# EAGLE design Gamebadge3_revD (EAGLE 8.7.1)
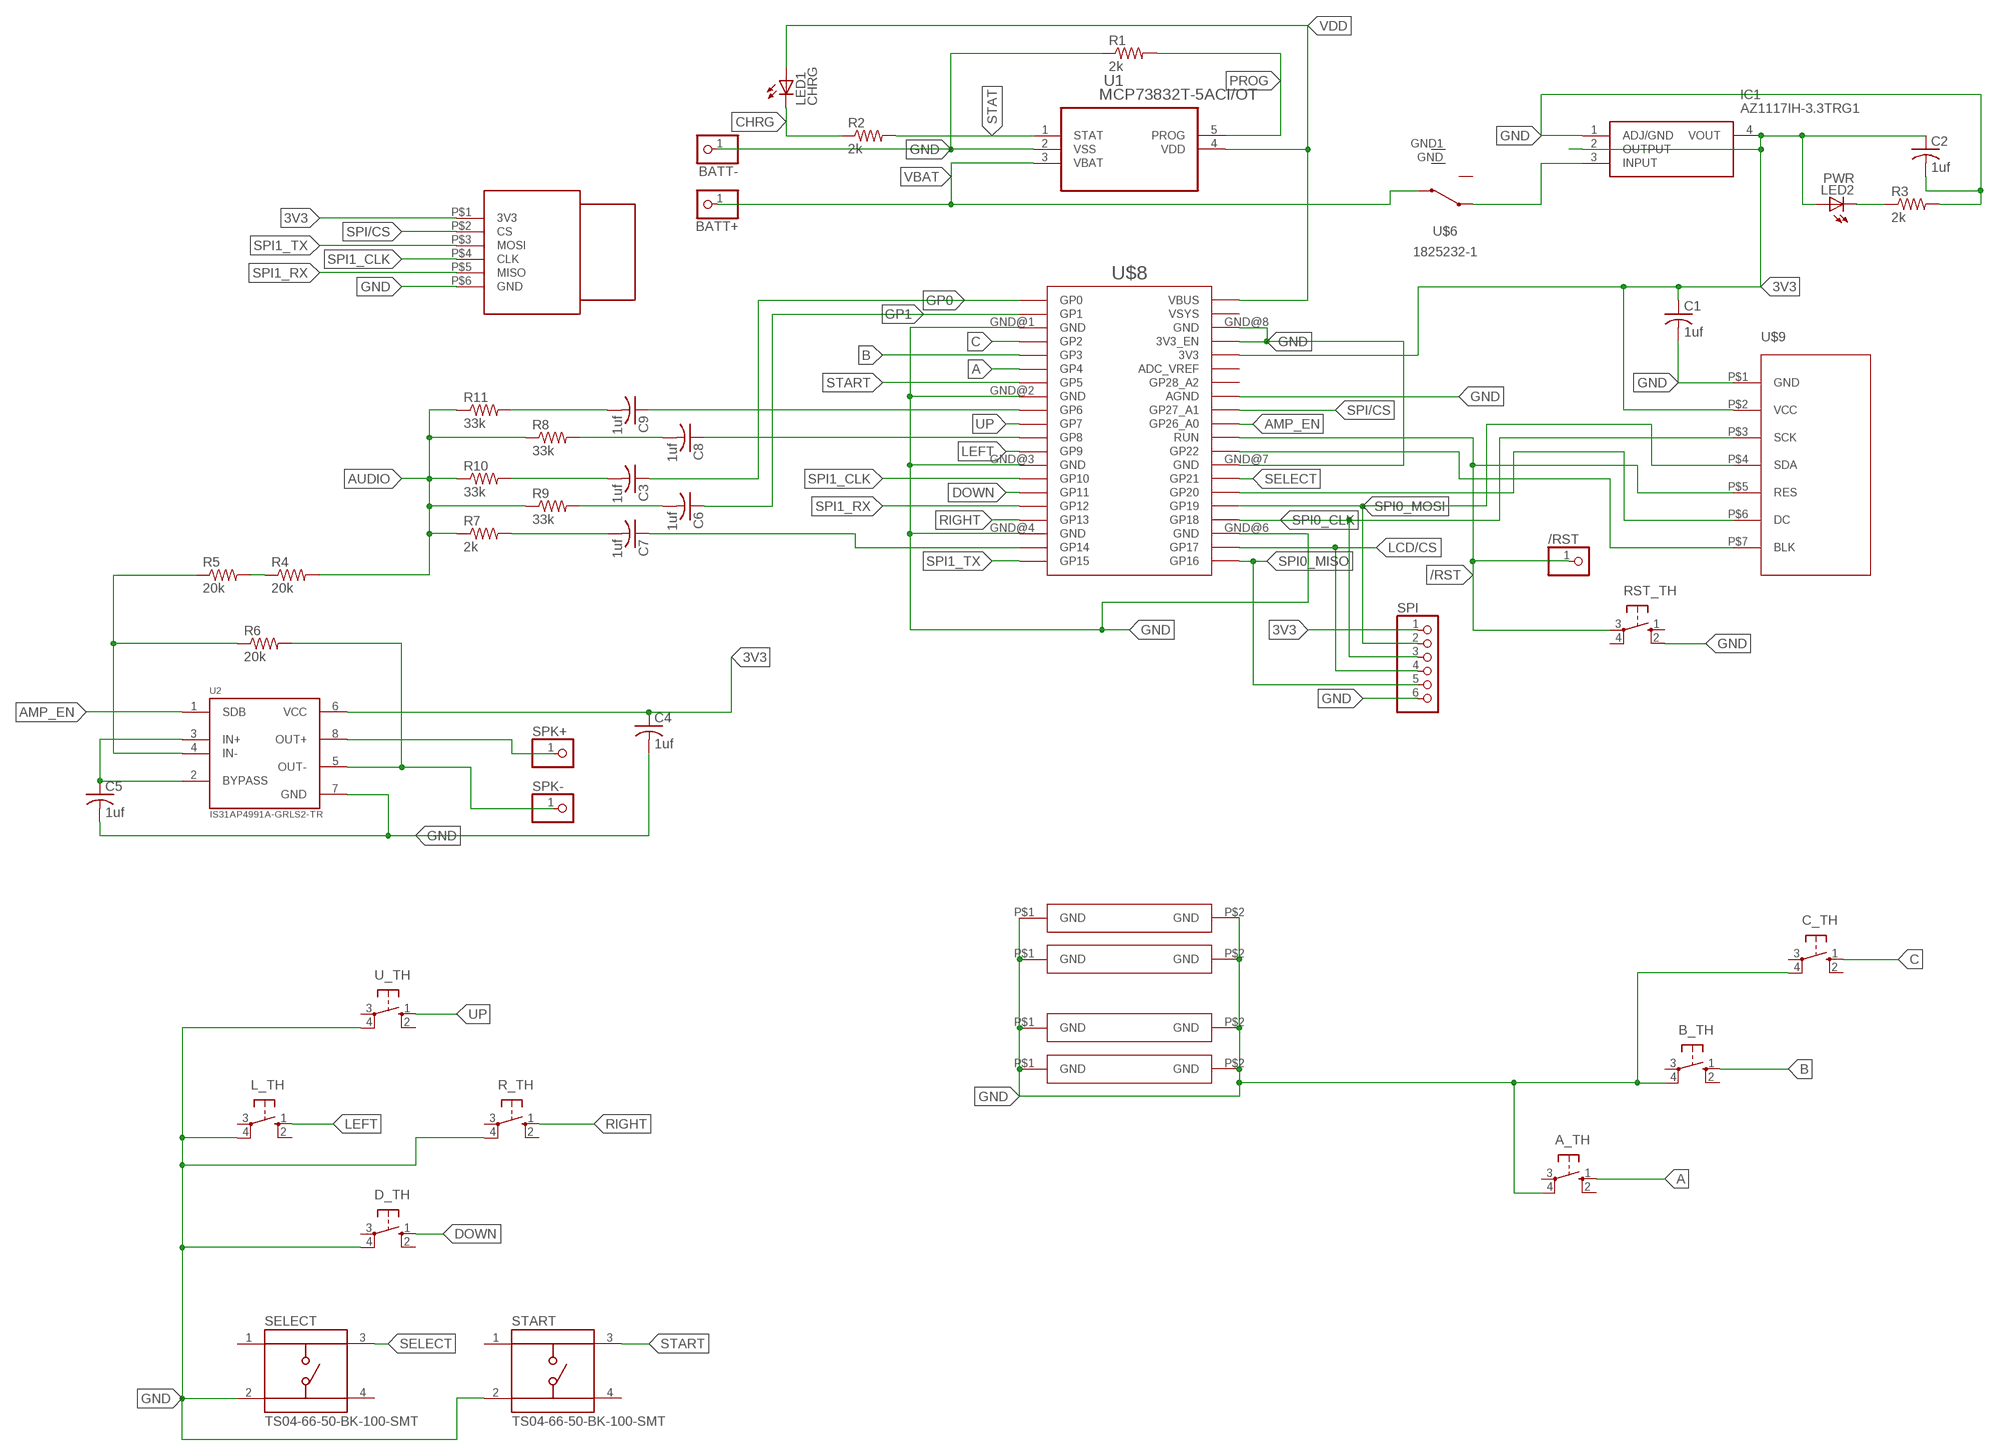
[diagram p0: schematic, sheet 1]

## Parts
/RST  PINHD-1X1  [1X01]
A_TH  10-XX  [B3F-10XX]
B_TH  10-XX  [B3F-10XX]
BATT+  PINHD-1X1  [1X01]
BATT-  PINHD-1X1  [1X01]
C1  1uf  C-USC0805  [C0805]
C2  1uf  C-USC0805  [C0805]
C3  1uf  C-USC0805  [C0805]
C4  1uf  C-USC0805  [C0805]
C5  1uf  C-USC0805  [C0805]
C6  1uf  C-USC0805  [C0805]
C7  1uf  C-USC0805  [C0805]
C8  1uf  C-USC0805  [C0805]
C9  1uf  C-USC0805  [C0805]
C_TH  10-XX  [B3F-10XX]
D_TH  10-XX  [B3F-10XX]
IC1  AZ1117IH-3.3TRG1  [SOT230P700X170-4N]
L_TH  10-XX  [B3F-10XX]
LED1  CHRG  LED3MM  [LED3MM]
LED2  PWR  LED3MM  [LED3MM]
R1  2k  R-US_R0805  [R0805]
R2  2k  R-US_R0805  [R0805]
R3  2k  R-US_R0805  [R0805]
R4  20k  R-US_R0805  [R0805]
R5  20k  R-US_R0805  [R0805]
R6  20k  R-US_R0805  [R0805]
R7  2k  R-US_R0805  [R0805]
R8  33k  R-US_R0805  [R0805]
R9  33k  R-US_R0805  [R0805]
R10  33k  R-US_R0805  [R0805]
R11  33k  R-US_R0805  [R0805]
R_TH  10-XX  [B3F-10XX]
RST_TH  10-XX  [B3F-10XX]
SELECT  TS04-66-50-BK-100-SMT  [SW_TS04-66-50-BK-100-SMT]
SPI  PINHD-1X6  [1X06]
SPK+  PINHD-1X1  [1X01]
SPK-  PINHD-1X1  [1X01]
START  TS04-66-50-BK-100-SMT  [SW_TS04-66-50-BK-100-SMT]
U1  MCP73832T-5ACI/OT  [SOT95P300X145-5N]
U2  IS31AP4991A-GRLS2-TR  [SOIC127P604X170-8N]
U$1  SD_CARD_ADAPTER  [SD_CARD]
U$2  GND_CLIP  [GND_CLIP]
U$3  GND_CLIP  [GND_CLIP]
U$4  GND_CLIP  [GND_CLIP]
U$5  GND_CLIP  [GND_CLIP]
U$6  1825232-1  [1825232-1]
U$8  RPI_PICO_W  [RPI_PICO_W]
U$9  ST7789  [ST7789]
U_TH  10-XX  [B3F-10XX]

## Nets
3V3: C1.1 C2.1 C4.1 IC1.2(OUTPUT) IC1.4(VOUT) LED2.A SPI.1 U2.6(VCC) U$1.P$1(3V3) U$8.3V3 U$9.P$2(VCC)
/RST: /RST.1 RST_TH.3(P) U$8.RUN U$9.P$5(RES)
A: A_TH.1(S) U$8.GP4
AMP_EN: U2.1(SDB) U$8.GP26_A0
AUDIO: R4.2 R7.1 R8.1 R9.1 R10.1 R11.1
B: B_TH.1(S) U$8.GP3
C: C_TH.1(S) U$8.GP2
CHRG: LED1.K(C) R2.1
DOWN: D_TH.1(S) U$8.GP11
GND: A_TH.4(P1) B_TH.4(P1) BATT-.1 C1.2 C2.2 C4.2 C5.2 C_TH.4(P1) D_TH.4(P1) IC1.1(ADJ/GND) L_TH.4(P1) R1.1 R3.2 R_TH.4(P1) RST_TH.2(S1) SELECT.2 SPI.6 START.2 U1.2(VSS) U2.7(GND) U$1.P$6(GND) U$2.P$1(GND) U$2.P$2(GND) U$3.P$1(GND) U$3.P$2(GND) U$4.P$1(GND) U$4.P$2(GND) U$5.P$1(GND) U$5.P$2(GND) U$8.3V3_EN U$8.AGND U$8.GND@1(GND) U$8.GND@2(GND) U$8.GND@3(GND) U$8.GND@4(GND) U$8.GND@6(GND) U$8.GND@7(GND) U$8.GND@8(GND) U$9.P$1(GND) U_TH.4(P1)
GP0: C3.1 U$8.GP0
GP1: C6.1 U$8.GP1
LCD/CS: SPI.4 U$8.GP17
LEFT: L_TH.1(S) U$8.GP9
N$1: C5.1 U2.2(BYPASS) U2.3(IN+)
N$3: U$8.GP20 U$9.P$6(DC)
N$4: R4.1 R5.2
N$5: U$8.GP22 U$9.P$7(BLK)
N$6: R5.1 R6.1 U2.4(IN-)
N$7: IC1.3(INPUT) U$6.3
N$8: R6.2 SPK-.1 U2.5(OUT-)
N$9: LED2.K(C) R3.1
N$10: SPK+.1 U2.8(OUT+)
N$12: C7.1 U$8.GP14
N$14: C6.2 R9.2
N$15: C7.2 R7.2
N$16: C8.1 U$8.GP8
N$17: C8.2 R8.2
N$18: C3.2 R10.2
N$22: C9.1 U$8.GP6
N$23: C9.2 R11.2
PROG: R1.2 U1.5(PROG)
RIGHT: R_TH.1(S) U$8.GP13
SELECT: SELECT.3 U$8.GP21
SPI0_CLK: SPI.3 U$8.GP18 U$9.P$3(SCK)
SPI0_MISO: SPI.5 U$8.GP16
SPI0_MOSI: SPI.2 U$8.GP19 U$9.P$4(SDA)
SPI1_CLK: U$1.P$4(CLK) U$8.GP10
SPI1_RX: U$1.P$5(MISO) U$8.GP12
SPI1_TX: U$1.P$3(MOSI) U$8.GP15
SPI/CS: U$1.P$2(CS) U$8.GP27_A1
START: START.3 U$8.GP5
STAT: R2.2 U1.1(STAT)
UP: U$8.GP7 U_TH.1(S)
VBAT: BATT+.1 U1.3(VBAT) U$6.2
VDD: LED1.A U1.4(VDD) U$8.VBUS
Unconnected: A_TH.2(S1) A_TH.3(P) B_TH.2(S1) B_TH.3(P) C_TH.2(S1) C_TH.3(P) D_TH.2(S1) D_TH.3(P) L_TH.2(S1) L_TH.3(P) R_TH.2(S1) R_TH.3(P) RST_TH.1(S) RST_TH.4(P1) SELECT.1 SELECT.4 START.1 START.4 U$6.1 U$6.GND U$6.GND1 U$8.ADC_VREF U$8.GP28_A2 U$8.VSYS U_TH.2(S1) U_TH.3(P)

## Library data of the parts
/RST BATT+ BATT- SPK+ SPK- = adafruit:PINHD-1X1: Pin header 1x1 for 0.1" spacing With round pins
A_TH B_TH C_TH D_TH L_TH R_TH RST_TH U_TH = switch-omron:10-XX: OMRON SWITCH; MPN: B3F-1000; OC_FARNELL: 176432; OC_NEWARK: 36M3542
C1-C9 = adafruit:C-US: CAPACITOR, American symbol
IC1 = AZ1117IH-3.3TRG1:AZ1117IH-3.3TRG1: LDO Voltage Regulators LDO BJT HiCurr 1.35A 10Hz to 10KHz Source: Datasheet Check availability <https://pricing.snapeda.com/parts/AZ1117IH-3.3TRG1/Diodes%20Inc./view-part?ref=eda>; AVAILABILITY: In Stock; DESCRIPTION: Linear Voltage Regulator IC Positive Fixed 1 Output 1A SOT-223-3; MF: Diodes Inc.; MP: AZ1117IH-3.3TRG1; PACKAGE: SOT-223 Diodes Inc.; PRICE: None; PURCHASE-URL: https://pricing.snapeda.com/search/part/AZ1117IH-3.3TRG1/?ref=eda
LED1 LED2 = adafruit:LED: LED OSRAM: - CHIPLED LG R971, LG N971, LY N971, LG Q971, LY Q971, LO R971, LY R971 LH N974, LH R974 LS Q976, LO Q976, LY Q976 LO Q996 - Hyper CHIPLED LW Q18S LB Q993, LB Q99A, LB R99A - SideLED LS A670, LO A670, LY A670, LG A670, LP A670 LB A673, LV A673, LT A673, LW A673 LH A674 LY A675 LS A676, LA A676, LO A676, LY A676, LW A676 LS A679, LY A679, LG A679 - Hyper Micro SIDELED® LS Y876, LA Y876, LO Y876, LY Y876 LT Y87S - SmartLED LW L88C, LW L88S LB L89C, LB L89S, LG L890 LS L89K, LO L89K, LY L89K LS L896, LA L896, LO L896, LY L896 - TOPLED LS T670, LO T670, LY T670, LG T670, LP T670 LSG T670, LSP T670, LSY T670, LOP T670, LYG T670 LG T671, LOG T671, LSG T671 LB T673, LV T673, LT T673, LW T673 LH T674 LS T676, LA T676, LO T676, LY T676, LB T676, LH T676, LSB T676, LW T676 LB T67C, LV T67C, LT T67C, LS T67K, LO T67K, LY T67K, LW E67C LS E67B, LA E67B, LO E67B, LY E67B, LB E67C, LV E67C, LT E67C LW T67C LS T679, LY T679, LG T679 LS T770, LO T770, LY T770, LG T770, LP T770 LB T773, LV T773, LT T773, LW T773 LH T774 LS E675, LA E675, LY E675, LS T675 LS T776, LA T776, LO T776, LY T776, LB T776 LHGB T686 LT T68C, LB T68C - Hyper Mini TOPLED® LB M676 - Mini TOPLED Santana® LG M470 LS M47K, LO M47K, LY M47K Source: http://www.osram.convergy.de/
R1-R11 = resistor:R-US_: RESISTOR, American symbol
SELECT START = TS04-66-50-BK-100-SMT:TS04-66-50-BK-100-SMT: Check availability <https://pricing.snapeda.com/parts/TS04-66-50-BK-100-SMT/CUI%20Devices/view-part?ref=eda>; AVAILABILITY: In Stock; CUI_PURCHASE_URL: https://www.cuidevices.com/product/switches/tactile-switches/ts04-series?utm_source=snapeda.com&utm_medium=referral&utm_campaign=snapedaBOM; DESCRIPTION: 6 x 6 mm, 4.3~9.5 mm Actuator Height, 100~260 gf, Surface Mount, SPST, Tactile Switch; MF: CUI Devices; MP: TS04-66-50-BK-100-SMT; PACKAGE: None; PRICE: None; PURCHASE-URL: https://pricing.snapeda.com/search/part/TS04-66-50-BK-100-SMT/?ref=eda
SPI = adafruit:PINHD-1X6: PIN HEADER
U1 = MCP73832T-5ACI_OT:MCP73832T-5ACI/OT: IC, BATT CHARGER, Li-Ion Li-Polymer, 500 mA Check availability <https://pricing.snapeda.com/parts/MCP73832T-5ACI/OT/Microchip/view-part?ref=eda>; AVAILABILITY: In Stock; DESCRIPTION: Charger IC Lithium Ion/Polymer SOT-23-5; MF: Microchip; MP: MCP73832T-5ACI/OT; PACKAGE: SOT-23 Microchip; PRICE: None; PURCHASE-URL: https://pricing.snapeda.com/search/part/MCP73832T-5ACI/OT/?ref=eda
U2 = IS31AP4991A-GRLS2-TR:IS31AP4991A-GRLS2-TR: Ic Audio Pwr Amp 1.1w 8soic Check availability <https://pricing.snapeda.com/parts/IS31AP4991A-GRLS2-TR/Lumissil%20Microsystems/view-part?ref=eda>; AVAILABILITY: In Stock; DESCRIPTION: Audio Amp Speaker 1-CH Mono 1.4W Class-AB 8-Pin SOP T/R; MF: Lumissil Microsystems; MP: IS31AP4991A-GRLS2-TR; PACKAGE: None; PRICE: None; PURCHASE-URL: https://pricing.snapeda.com/search/part/IS31AP4991A-GRLS2-TR/?ref=eda
U$1 = SD card adapter:SD_CARD_ADAPTER
U$2-U$5 = MGC 2023:GND_CLIP
U$6 = switch 1825232-1:1825232-1: Check prices <https://pricing.snapeda.com/parts/1825232-1/TE%20Connectivity/view-part?ref=eda>; AVAILABILITY: In Stock; COMMENT: 1825232-1; DESCRIPTION: Switch Slide ON None ON SPDT Side Slide 0.2A 30VDC 10000Cycle PC Pins Bracket Mount/Through Hole; EU_ROHS_COMPLIANCE: Compliant; MF: TE Connectivity; MP: 1825232-1; PACKAGE: None; PRICE: None; PURCHASE-URL: https://pricing.snapeda.com/search/part/1825232-1/?ref=eda
U$8 = RaspberryPi_Pico W:RPI_PICO_W
U$9 = MGC 2023:ST7789

## Board
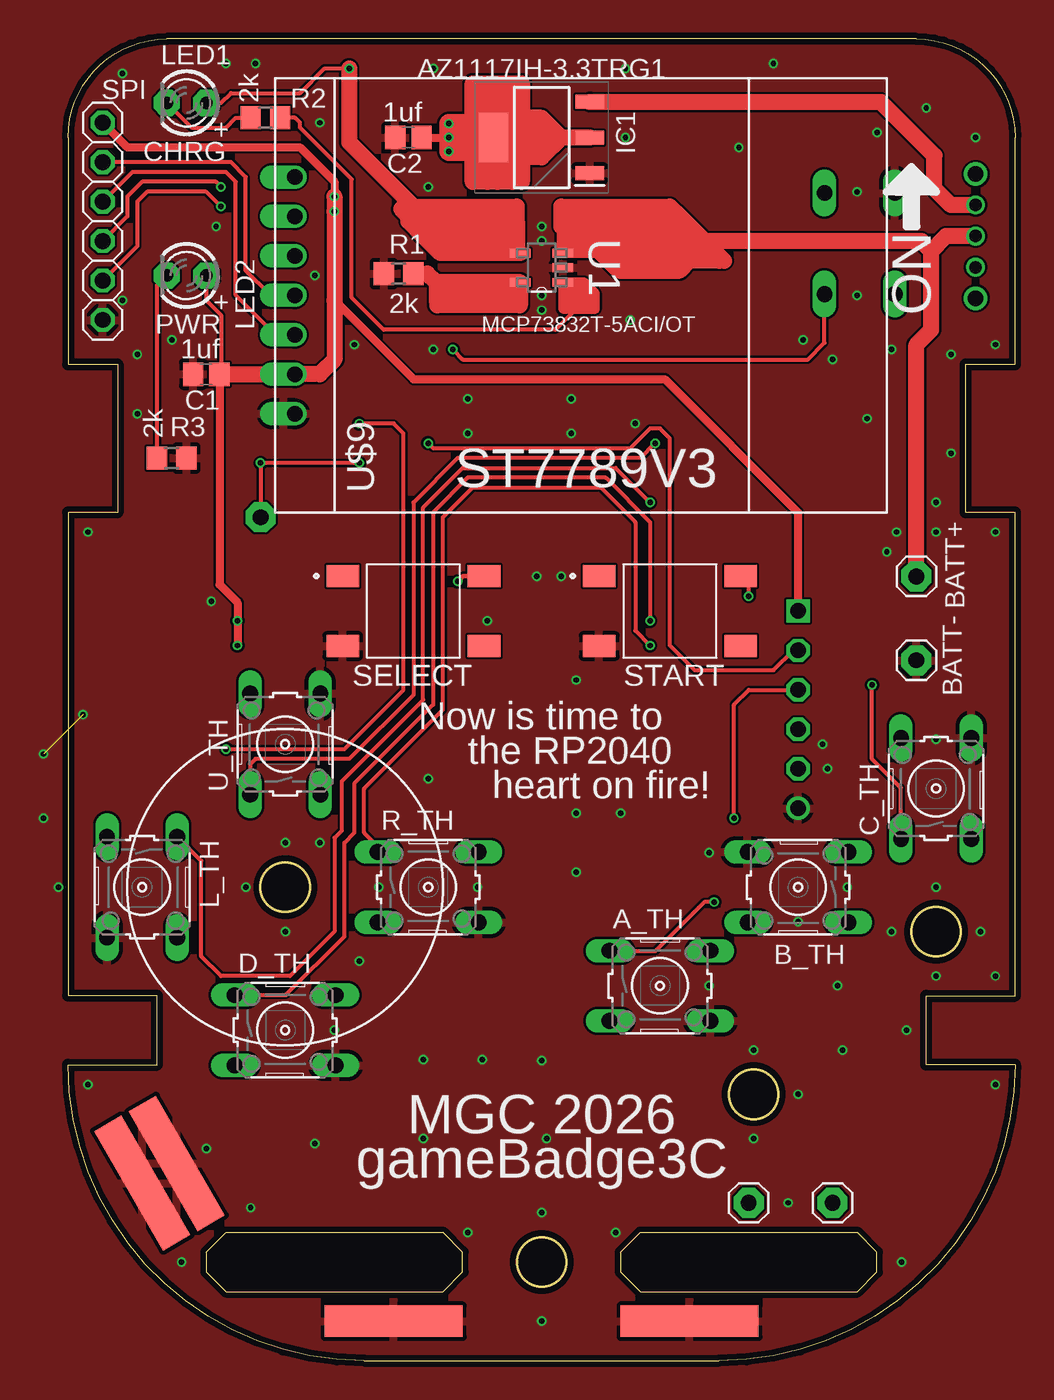
[diagram p1: board, top side]
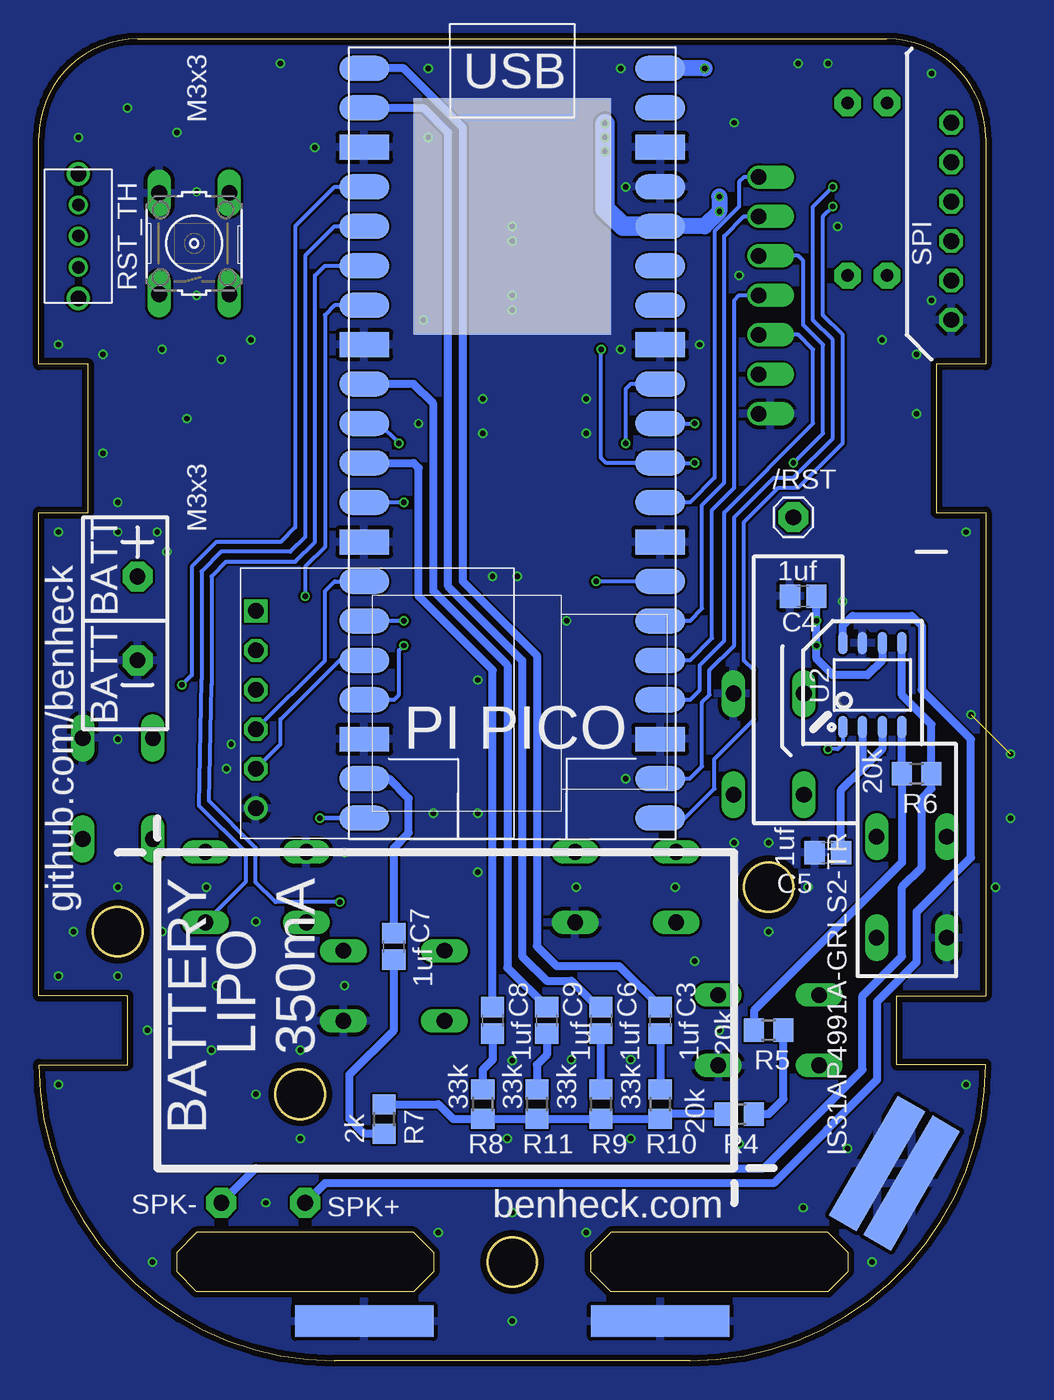
[diagram p2: board, bottom side, seen from below]

Size 60.96 x 85.09 mm. Coordinates in mm from the lower left corner, seen from the top.
Outline: 60.96,23.5 60.96,54.61 57.78,54.61 57.78,64.14 60.96,64.14 60.96,78.74 arc90 54.61,85.09 6.35,85.09 arc90 0,78.74 0,64.14 3.18,64.14 3.18,54.61 0,54.61 0,23.5 5.71,23.5 5.71,19.05 0,19.05 arc90 19.05,0 41.91,0 arc90 60.96,19.05 55.25,19.05 55.25,23.5 60.96,23.5
Outline: 36.83,8.26 50.8,8.26 52.07,6.98 52.07,5.72 50.8,4.45 36.83,4.45 35.56,5.72 35.56,6.98 36.83,8.26
Outline: 10.16,8.26 24.13,8.26 25.4,6.98 25.4,5.72 24.13,4.45 10.16,4.45 8.89,5.72 8.89,6.98 10.16,8.26
Outline: circle at 13.97,30.48 radius 1.59
Outline: circle at 30.48,6.35 radius 1.59
Outline: circle at 55.88,27.62 radius 1.59
Outline: circle at 44.13,17.15 radius 1.59
Copper layers (1*16): Top 0.035559375mm / dielectric 1.6mm / Bottom 0.035559375mm
Design rules "oshpark-2layer": minimum track width 6mil, minimum drill 10mil, track to track 6mil, track to pad 6mil, pad to pad 6mil, via to via 6mil, smd to smd 6mil, copper to edge 15mil, drill to drill 6mil, minimum pad ring 5mil, minimum via ring 5mil, stop-mask expansion 2.5mil, vias tented up to drill 0mil, thermal gap 10mil

### Footprints (pad centres in the part's own frame; a part is rotated, then mirrored left to right if it is on the bottom)
1X01 = drill 1.016 pad 1.93 octagon: 1 0,0
B3F-10XX = drill 1.016 long: 1 -3.251,2.261; 2 3.251,2.261; 3 -3.251,-2.261; 4 3.251,-2.261
C0805 = smd 1.3 x 1.5: 1 -0.85,0; 2 0.85,0
SOT230P700X170-4N = smd 1.85 x 0.9: 1 -3.1,2.3; 2 -3.1,0; 3 -3.1,-2.3 | smd 1.85 x 3.2: 4 3.1,0
LED3MM = drill 0.813 pad 1.676 octagon: A -1.27,0; K 1.27,0
R0805 = smd 1.3 x 1.5: 1 -0.95,0; 2 0.95,0
SW_TS04-66-50-BK-100-SMT = smd 2.1 x 1.4: 1 -4.55,2.25; 2 -4.55,-2.25; 3 4.55,2.25; 4 4.55,-2.25
1X06 = drill 1.016 octagon: 1 -6.35,0; 2 -3.81,0; 3 -1.27,0; 4 1.27,0; 5 3.81,0; 6 6.35,0
SOT95P300X145-5N = smd 1.321 x 0.559: 1 -1.372,0.94; 2 -1.372,0; 3 -1.372,-0.94; 4 1.372,-0.94; 5 1.372,0.94
SOIC127P604X170-8N = smd 1.45 x 0.6: 1 -2.7,1.905; 2 -2.7,0.635; 3 -2.7,-0.635; 4 -2.7,-1.905; 5 2.7,-1.905; 6 2.7,-0.635; 7 2.7,0.635; 8 2.7,1.905
SD_CARD = drill 1 square: P$1 -6.35,0 | drill 1 octagon: P$2 -3.81,0; P$3 -1.27,0; P$4 1.27,0; P$5 3.81,0 | drill 1: P$6 6.35,0
GND_CLIP = smd 8.89 x 2.032: P$1 0,0 | smd 8.89 x 2.032 bottom: P$2 0,0
1825232-1 = drill 0.8: 1 -2,0; 2 0,0; 3 2,0 | drill 1: GND -4,0; GND1 4,0
RPI_PICO_W = smd 3.2 x 1.6: 3V3 9.525,13.97; 3V3_EN 9.525,16.51; ADC_VREF 9.525,11.43; AGND 9.525,6.35; GND@1 -9.525,19.05; GND@2 -9.525,6.35; GND@3 -9.525,-6.35; GND@4 -9.525,-19.05; GND@6 9.525,-19.05; GND@7 9.525,-6.35; GND@8 9.525,19.05; GP0 -9.525,24.13; GP1 -9.525,21.59; GP2 -9.525,16.51; GP3 -9.525,13.97; GP4 -9.525,11.43; GP5 -9.525,8.89; GP6 -9.525,3.81; GP7 -9.525,1.27; GP8 -9.525,-1.27; GP9 -9.525,-3.81; GP10 -9.525,-8.89; GP11 -9.525,-11.43; GP12 -9.525,-13.97; GP13 -9.525,-16.51; GP14 -9.525,-21.59; GP15 -9.525,-24.13; GP16 9.525,-24.13; GP17 9.525,-21.59; GP18 9.525,-16.51; GP19 9.525,-13.97; GP20 9.525,-11.43; GP21 9.525,-8.89; GP22 9.525,-3.81; GP26_A0 9.525,1.27; GP27_A1 9.525,3.81; GP28_A2 9.525,8.89; RUN 9.525,-1.27; VBUS 9.525,24.13; VSYS 9.525,21.59
ST7789 = drill 1 offset: P$1 -7.62,0; P$2 -5.08,0; P$3 -2.54,0; P$4 0,0; P$5 2.54,0; P$6 5.08,0; P$7 7.62,0

### Placement (x,y rotation side)
/RST  12.38,54.29 0 bottom
A_TH  38.1,24.13 0 top
B_TH  46.99,30.48 180 top
BATT+  54.61,50.48 180 top
BATT-  54.61,45.09 0 top
C1  8.89,63.5 180 top
C2  21.91,78.74 180 top
C3  20.95,21.91 270 bottom
C4  11.75,49.21 180 bottom
C5  10.16,32.7 180 bottom
C6  24.77,21.91 270 bottom
C7  38.1,26.67 270 bottom
C8  31.75,21.91 270 bottom
C9  28.26,21.91 270 bottom
C_TH  55.88,36.83 90 top
D_TH  13.97,21.27 0 top
IC1  30.48,78.74 180 top
L_TH  4.76,30.48 270 top
LED1  7.62,80.96 180 top
LED2  7.62,69.85 180 top
R1  21.27,69.98 0 top
R2  12.7,80.01 0 top
R3  6.67,58.1 0 top
R4  15.88,15.88 180 bottom
R5  13.97,21.27 0 bottom
R6  4.45,37.78 0 bottom
R7  38.73,15.56 270 bottom
R8  32.38,16.51 90 bottom
R9  24.77,16.51 90 bottom
R10  20.95,16.51 90 bottom
R11  28.89,16.51 90 bottom
R_TH  23.18,30.48 0 top
RST_TH  50.96,71.91 90 bottom
SELECT  22.23,48.26 0 top
SPI  2.22,73.34 270 top
SPK+  43.81,10.16 0 top
SPK-  49.21,10.16 0 top
START  38.73,48.26 0 top
U1  30.48,70.36 180 top
U2  7.3,43.5 90 bottom
U$1  46.99,41.91 270 bottom
U$2  20.95,2.54 0 top
U$3  40.01,2.54 0 top
U$4  6.98,12.7 300 top
U$5  4.76,11.43 300 top
U$6  58.42,72.39 90 bottom
U$8  30.48,59.05 0 bottom
U$9  14.61,68.58 90 top
U_TH  13.97,39.69 90 top

### Tracks (layer width: path | path; a pad name or v marks a point on that pad's centre or on a via)
3V3  (via drill 0.35)
  Top 0.254: LED2.A 8.89,68.26 9.84,67.31 9.84,63.6 C1.1
  Top 0.508: C2.1 v24.51,78.74 | SPI.1 3.81,78.11 14.92,78.11 17.14,75.88 v17.14,74.93 16.99,74.45 v17.14,73.98 | 17.14,68.26 22.23,63.18 38.42,63.18 46.99,54.61 U$1.P$1 | C1.1 9.74,49.95 10.9,48.79 v10.9,47.62 v10.9,46.04
  Top 1.016: 31.75,78.74 26.04,78.74 | IC1.2 31.75,78.74 | 31.12,79.38 30.48,80.01 27.94,80.01 27.56,79.63 | IC1.4 28.02,79.38 31.12,79.38 | 31.12,79.38 31.75,78.74 | 31.75,78.74 30.48,77.47 27.94,77.47 27.94,78.11 30.48,78.11 | 26.04,78.74 26.04,79.63 26.04,82.23 26.99,82.23 | 26.99,82.23 27.62,82.23 | 27.62,82.23 28.57,82.23 | 28.57,82.23 29.21,82.23 29.21,75.88 28.57,75.88 | 28.57,75.88 27.62,75.88 | 27.62,75.88 26.99,75.88 | 26.99,75.88 26.04,75.88 26.04,78.74 | 26.99,82.23 26.99,75.88 | 27.62,75.88 27.62,82.23 | 28.57,82.23 28.57,75.88 | v17.14,74.93 v17.14,73.98 17.14,68.26 17.14,64.45 16.19,63.5 U$9.P$2 C1.1
  Top 1.27: v24.51,78.74 26.04,78.74 26.8,78.74 | v24.51,78.74 v24.51,79.63 26.04,79.63 27.56,79.63 27.3,79.38 27.3,77.85 v24.51,77.85 v24.51,78.74
  Bottom 0.508: U2.6 6.67,45.09 7.62,44.13 9.84,44.13 10.9,45.19 v10.9,46.04 v10.9,47.62 C4.1 10.8,49.32
  Bottom 1.016: U$8.3V3 18.1,73.03 v17.14,73.98 v17.14,74.93
  Bottom 1.27: v24.51,79.63 v24.51,78.74 v24.51,77.85 24.51,74.17 23.37,73.03 U$8.3V3
/RST  (via drill 0.35)
  Top 0.254: v18.73,57.79 v12.38,57.79 /RST.1 | v24.77,65.09 25.4,64.45 47.62,64.45 48.7,65.53 RST_TH.3
  Bottom 0.254: v24.77,65.09 24.77,58.1 24.45,57.79 U$8.RUN v18.73,57.79 | v12.38,57.79 10.48,59.69 10.48,65.41 11.75,66.67 11.75,70.8 12.07,71.12 U$9.P$5
A  (via drill 0.35)
  Top 0.254: A_TH.1 34.89,26.35 37.78,26.35 40.96,29.53 v41.59,29.53
  Bottom 0.254: U$8.GP4 42.55,70.48 43.18,69.85 43.18,52.71 44.45,51.44 48.89,51.44 49.85,50.48 49.85,43.5 50.01,36.04 46.99,33.02 46.99,30.8 45.72,29.53 v41.59,29.53
AMP_EN  (via drill 0.35)
  Top 0.254: v10.16,39.37 17.78,39.37 21.59,43.18 21.59,59.69 U$8.GP26_A0 v18.73,60.33
  Bottom 0.254: v10.16,39.37 9.53,39.37 9.21,39.69 U2.1 | U$8.GP26_A0 v18.73,60.33
AUDIO
  Bottom 0.508: R7.1 35.24,16.51 34.29,15.56 R8.1 R11.1 R9.1 R10.1 20.64,15.88 R4.2
B
  Bottom 0.254: U$8.GP3 41.91,73.03 43.81,71.12 43.81,53.02 44.77,52.07 49.21,52.07 50.48,50.8 50.48,43.82 50.64,35.72 47.62,32.7 47.62,30.84 B_TH.1
C  (via drill 0.35)
  Top 0.254: C_TH.1 53.62,36.87 51.75,38.73 v51.75,43.5
  Bottom 0.254: U$8.GP2 41.91,75.56 44.45,73.03 44.45,53.66 45.4,52.71 49.53,52.71 51.12,51.12 51.12,44.13 v51.75,43.5
CHRG
  Top 0.254: LED1.K 7.94,79.38 10.16,79.38 10.8,80.01 R2.1
DOWN  (via drill 0.35)
  Top 0.254: v37.47,47.62 37.47,53.98 34.61,56.83 25.72,56.83 23.5,54.61 23.5,42.23 18.41,37.15 18.41,33.97 17.78,33.34 17.78,27.31 14.01,23.53 D_TH.1
  Bottom 0.254: v37.47,47.62 U$8.GP11
GND  (via drill 0.35)  (1 unrouted)
  other vias: 15.88,69.85 30.48,72.07 30.48,73.03 30.48,68.58 30.48,67.63 12.07,83.5 6.67,65.72 16.19,79.69 4.45,60.96 25.72,61.91 8.89,13.65 22.86,19.37 49.85,20 26.67,19.37 53.98,21.27 30.48,9.53 49.53,24.13 30.48,19.3 52.7,52.07 56.83,58.42 53.34,53.34 55.88,55.25 55.88,40.01 48.89,38.1 30.16,50.48 32.38,59.69 25.72,59.69 32.38,61.91 35.88,78.74 53.02,65.09 23.5,83.19 43.18,78.11 50.8,68.58 47.31,65.72 56.83,64.77 -0.63,30.48 23.18,37.47 18.73,25.72 59.69,24.77 0.95,41.59 30.8,14.29 17.14,21.27 15.88,13.97 25.72,8.26 35.24,8.26 53.66,6.35 7.3,6.35 1.27,17.78 59.69,17.78 55.88,24.77 30.48,2.54 50.16,30.48 53.02,27.62 35.56,35.24 20,30.48 4.45,64.77 3.49,82.87 45.4,83.5 52.07,79.06 26.99,47.62 -1.59,39.05 55.25,80.65 55.88,53.34 49.21,64.45 44.13,14.29 46.36,10.16 32.7,31.43 11.75,9.84 13.97,27.62 13.97,33.34 11.43,30.48 16.19,33.34 26.35,30.48 41.27,32.7 41.27,24.13 48.58,39.69 32.7,43.82 31.75,50.48 18.41,65.41 35.88,83.19 36.51,60.33 51.44,60.64 -1.59,34.93 50.8,75.25 9.21,48.9 1.27,53.34 9.53,73.03 23.18,75.56 10.16,83.5 32.7,35.24 46.99,28.26 44.13,20 22.86,14.29 46.99,17.15 55.88,30.48 58.74,27.62 59.69,53.34 59.69,65.41 58.42,78.74 36.2,66.99 3.49,68.26 23.5,65.09
  pour Top: -12.7,96.52 78.74,96.52 78.74,-7.62 76.2,-10.16 -7.62,-10.16 -17.78,0 -17.78,91.44
  pour Bottom: -7.62,96.52 68.58,96.52 71.12,93.98 73.66,91.44 73.66,-7.62 68.58,-12.7 -10.16,-12.7 -15.24,-7.62 -15.24,93.98 -12.7,96.52
GP0
  Bottom 0.508: U$8.GP0 37.47,83.19 33.66,79.38 33.66,50.17 28.89,45.4 28.89,26.67 27.62,25.4 23.6,25.4 C3.1
GP1
  Bottom 0.508: U$8.GP1 36.2,80.65 34.61,79.06 34.61,49.85 29.84,45.09 29.84,26.04 28.26,24.45 26.67,24.45 24.98,22.76 C6.1
LCD/CS  (via drill 0.35)
  Top 0.254: v9.84,75.56 9.53,75.88 4.76,75.88 3.81,74.93 3.81,73.66 SPI.4
  Bottom 0.254: U$8.GP17 19.05,37.47 18.26,38.26 18.26,42.39 17.78,42.86 17.78,44.45 16.19,46.04 16.19,54.29 13.65,56.83 12.38,56.83 9.84,59.37 9.84,65.72 11.11,66.99 11.11,74.3 v9.84,75.56
LEFT  (via drill 0.35)
  Top 0.254: v37.47,55.25 35.24,57.47 25.4,57.47 22.86,54.93 22.86,42.55 17.62,37.31 17.62,34.13 17.14,33.66 17.14,27.62 14.29,24.77 9.84,24.77 8.57,26.04 8.57,32.18 L_TH.1
  Bottom 0.254: v37.47,55.25 U$8.GP9
N$1
  Bottom 0.508: U2.2 7.94,38.1 | U2.3 6.67,39.37 7.94,38.1 | C5.1 9.31,36.73 7.94,38.1
N$3
  Bottom 0.254: U$8.GP20 19.05,47.62 18.26,48.42 18.26,55.09 16.83,56.52 16.83,72.39 15.56,73.66 U$9.P$6
N$4
  Bottom 0.508: R4.1 13.97,15.88 13.02,16.83 R5.2
N$5
  Bottom 0.254: U$8.GP22 20.64,55.25 19.69,55.25 19.05,55.25 17.46,56.83 17.46,72.71 15.88,74.3 15.88,75.88 15.56,76.2 U$9.P$7
N$6
  Bottom 0.508: U2.4 R6.1 5.39,32.07 14.92,22.55 R5.1
N$7
  Top 1.016: IC1.3 33.59,81.03 52.32,81.03 55.77,77.58 55.77,75.45 56.83,74.39 U$6.3
N$8
  Bottom 0.508: U2.5 5.4,42.86 3.5,40.96 R6.2 3.49,36.83 4.13,36.2 4.13,31.75 5.4,30.48 5.4,26.04 7.94,23.5 7.94,18.73 14.29,12.38 46.99,12.38 SPK-.1
N$9
  Top 0.254: R3.1 5.71,69.22 LED2.K
N$10
  Bottom 0.508: 9.21,46.67 U2.8 9.21,47.31 8.57,47.94 4.76,47.94 4.13,47.31 4.13,43.18 0.95,40.01 0.95,32.39 4.45,28.89 4.45,25.66 6.98,23.12 6.98,18.1 13.65,11.43 42.55,11.43 SPK+.1
N$12
  Bottom 0.508: 39.37,37.47 U$8.GP14 38.42,37.47 37.15,36.2 37.15,33.97 38.1,33.02 C7.1
N$14
  Bottom 0.508: R9.2 C6.2
N$15
  Bottom 0.508: R7.2 40,14.61 40.01,14.61 40.96,15.56 40.96,18.41 38.1,21.27 C7.2
N$16
  Bottom 0.508: U$8.GP8 36.83,57.79 36.51,57.47 36.51,49.21 31.75,44.45 C8.1
N$17
  Bottom 0.508: C8.2 31.75,19.37 32.38,18.73 R8.2
N$18
  Bottom 0.508: C3.2 R10.2
N$22
  Bottom 0.508: U$8.GP6 36.83,62.87 35.56,61.59 35.56,49.53 30.8,44.77 30.8,25.3 C9.1
N$23
  Bottom 0.508: C9.2 28.26,19.69 28.89,19.05 R11.2
PROG
  Top 0.254: 28.83,68.45 29.08,68.71
  Top 0.508: 23.11,69.98 23.84,69.25 24.38,68.71
  Top 1.016: 25.09,69.42 U1.5 29.08,69.39 29.08,68.71 | 25.09,69.42 24.38,68.71 | 24.38,68.71 29.08,68.71 | 29.08,68.71 29.08,67.95 23.75,67.95 | 23.75,67.95 25.09,69.29 25.09,69.42 | 24.38,68.71 23.75,68.07 | 23.75,68.07 23.75,67.95 | 25.09,69.42 23.67,69.42 23.11,69.98 R1.2 | 23.75,68.07 23.75,69.15 23.84,69.25
RIGHT  (via drill 0.35)
  Top 0.254: R_TH.1 19.93,33.1 19.05,33.97 19.05,36.83 24.13,41.91 24.13,54.29 26.04,56.2 34.29,56.2 36.51,53.98 36.51,46.99 v37.47,46.04
  Bottom 0.254: U$8.GP13 38.1,42.55 37.78,42.86 37.78,45.72 v37.47,46.04
SELECT  (via drill 0.35)
  Top 0.305: SELECT.3 25.43,50.51 v25.08,50.17
  Bottom 0.254: U$8.GP21 v25.08,50.17
SPI0_CLK
  Top 0.254: U$9.P$3 13.34,66.04 10.8,68.58 10.8,75.88 10.16,76.52 4.13,76.52 SPI.3
  Bottom 0.254: U$8.GP18 19.05,42.55 18.41,43.18 18.41,44.77 16.83,46.36 16.83,54.61 11.11,60.33 11.11,65.09 12.07,66.04 U$9.P$3
SPI0_MISO  (via drill 0.35)
  Top 0.254: v9.84,74.3 8.89,75.25 5.08,75.25 4.45,74.61 4.45,71.75 SPI.5
  Bottom 0.254: U$8.GP16 19.37,34.93 17.46,36.83 17.46,38.73 14.92,41.28 14.92,44.45 15.56,45.09 15.56,53.98 13.34,56.2 12.07,56.2 9.21,59.05 9.21,66.04 10.48,67.31 10.48,73.66 v9.84,74.3
SPI0_MOSI
  Top 0.254: U$9.P$4 13.02,68.58 11.43,70.17 11.43,76.2 10.48,77.15 SPI.2
  Bottom 0.254: U$8.GP19 19.05,45.09 17.62,46.51 17.62,54.77 16.19,56.2 16.19,68.26 15.88,68.58 U$9.P$4 | 2.54,77.15 SPI.2
SPI1_CLK
  Bottom 0.254: U$8.GP10 41.91,50.17 42.55,49.53 42.55,45.09 U$1.P$4
SPI1_RX
  Bottom 0.254: U$8.GP12 41.59,45.09 45.4,41.28 45.4,39.69 U$1.P$5
SPI1_TX  (via drill 0.35)
  Top 0.254: v42.86,34.93 42.86,42.23 43.81,43.18 U$1.P$3
  Bottom 0.305: v42.86,34.93 U$8.GP15
SPI/CS  (via drill 0.35)
  Top 0.254: v23.18,59.05 23.5,58.74 36.2,58.74 37.47,60.01 38.1,60.01 38.73,59.37 38.73,46.04 40.32,44.45 45.4,44.45 46.67,45.72 U$1.P$2
  Bottom 0.254: U$8.GP27_A1 22.86,62.87 23.18,62.55 v23.18,59.05
START  (via drill 0.35)
  Top 0.254: v43.81,49.21 43.81,50.06 43.45,50.43
  Top 0.305: 43.45,50.43 43.28,50.58 START.3
  Bottom 0.254: U$8.GP5 41.91,67.95 42.55,67.31 42.55,52.39 43.81,51.12 v43.81,49.21
STAT
  Top 0.254: 33.15,68.58 33.02,68.71 | 32.7,67.69 31.37,66.36 20.32,66.36 18.26,68.42 18.26,76.04 14.92,79.38 14.92,79.69 14.61,80.01 R2.2
  Top 0.305: 33.34,68.71 33.47,68.58
  Top 0.508: 33.27,69.22 33.02,68.96 | 33.4,68.58 33.02,68.2
  Top 0.61: 31.85,68.96 U1.1 33.2,69.42 33.53,69.09 | 31.85,68.96 31.85,68.58 | 31.85,68.58 31.85,68.2 | 31.85,68.2 31.85,67.72 31.88,67.69 32.7,67.69 33.91,67.69 33.91,68.2 | 33.91,68.71 33.91,68.2 | 33.53,69.09 33.91,68.71 | 31.85,68.96 33.02,68.96 33.4,68.96 33.53,69.09 | 33.91,68.71 33.34,68.71 33.02,68.71 31.98,68.71 31.85,68.58 | 31.85,68.2 33.02,68.2 33.91,68.2
UP  (via drill 0.35)
  Top 0.254: v37.78,59.05 36.83,58.1 25.08,58.1 22.23,55.25 22.23,42.86 18.1,38.73 12.07,38.73 11.71,38.38 U_TH.1
  Bottom 0.254: v37.78,59.05 39.05,60.33 U$8.GP7
VBAT
  Top 0.508: 35.18,71.75 34.8,72.14 | 35.88,71.3 35.56,71.62 35.56,71.88 | 35.43,71.75 35.56,71.88 | 35.56,71.88 35.56,71.95
  Top 0.61: 34.86,72.45 34.92,72.39 34.99,72.33 34.8,72.14 31.75,72.14 | 34.86,72.45 34.61,72.71 34.29,73.03 31.75,73.03 31.75,72.52 | 31.75,72.52 31.75,72.14 | 31.75,72.14 31.75,71.75 | 31.75,71.75 31.75,71.4 U1.3 34.29,71.3 35.24,71.3 35.88,71.3 36.5,71.3 | 35.5,71.82 35.43,71.75 | 34.86,72.45 33.78,72.45 31.81,72.45 31.75,72.52 | 31.75,72.14 31.94,71.95 35.56,71.95 36.45,71.95 36.26,71.75 35.18,71.75 31.75,71.75
  Top 1.016: 33.97,72.64 33.78,72.45 | 34.61,72.71 34.92,72.39 36.2,72.39 | U$6.2 56.52,72.39 55.56,71.44 | 31.75,73.03 31.75,73.66 | 31.75,73.66 34.92,73.66 | 34.92,73.66 35.72,72.87 | 35.72,72.87 36.2,72.39 | 36.2,72.39 37.29,71.3 35.88,71.3 36.05,71.12 | 37.78,72.39 36.2,72.39 | 34.92,73.66 36.51,73.66 | 36.51,73.66 37.31,72.87 | 37.31,72.87 37.78,72.39 | 37.78,72.39 39.05,71.12 | 39.05,71.12 36.05,71.12 | 35.72,72.87 36.67,72.87 37.78,71.75 | 39.05,71.12 39.37,70.8 40.01,70.8 | 41.91,70.8 42.23,70.8 39.37,73.66 | 41.91,70.8 40.01,70.8 | 34.29,71.3 35.42,70.17 39.37,70.17 40.01,70.8 | 36.05,71.12 35.42,71.12 35.24,71.3 | 36.51,73.66 38.73,73.66 | 41.91,70.8 41.27,71.44 40.96,71.44 38.73,73.66 | 40.01,70.8 40.01,71.44 39.37,72.07 | 39.37,72.07 38.42,73.03 38.26,72.87 37.31,72.87 | 38.73,73.66 39.37,73.66 | 31.75,73.66 31.75,74.3 38.73,74.3 39.37,73.66 | BATT+.1 54.61,65.41 55.56,66.36 55.56,71.44 | 55.56,71.44 54.93,72.07 39.37,72.07
VDD  (via drill 0.35)
  Top 0.254: LED1.A 9.84,80.96 10.48,81.6 14.92,81.6 16.51,83.19 v18.1,83.19
  Top 1.016: 23.18,72.07 23.95,71.3 U1.4 28.89,71.51 28.89,72.07 | 22.86,72.39 21.91,73.34 28.89,73.34 | 28.89,73.34 28.89,72.71 | 28.89,72.71 28.89,72.07 | 28.89,72.71 22.86,72.71 | 22.86,72.71 22.86,72.39 | 22.86,72.39 23.18,72.07 | 23.18,72.07 28.89,72.07 | 28.89,73.34 28.89,74.3 | 22.86,72.71 21.43,74.14 | 28.89,74.3 28.73,74.14 22.38,74.14 | 22.38,74.14 21.43,74.14 | 21.43,74.14 21.59,74.3 28.89,74.3 | v18.1,83.19 18.1,78.42 22.38,74.14
  Bottom 1.016: v18.1,83.19 U$8.VBUS

### Text on the board
tPlace: ON | ST7789V3 | Now is time to | the RP2040 | heart on fire! | MGC 2026 | gameBadge3C
bPlace: USB | M3x3 | SPI | M3x3 | BATT | BATT | PI PICO | github.com/benheck | 350mA | LIPO | BATTERY | benheck.com